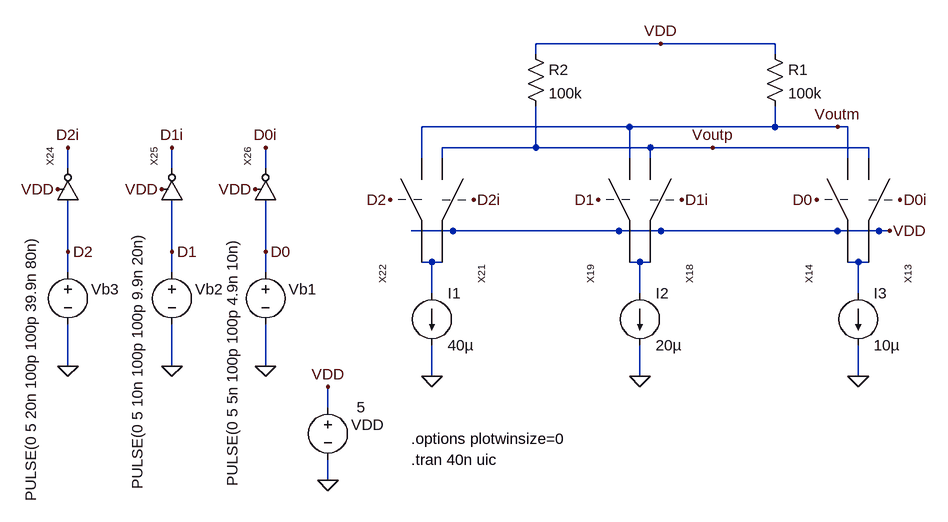
[diagram p0: schematic Fig29_10.asc]
Fig29_10.asc, the LTspice schematic file:
Version 4
SHEET 1 2492 2056
WIRE 1296 944 1104 944
WIRE 1472 944 1296 944
WIRE 1104 960 1104 944
WIRE 1472 960 1472 944
WIRE 1248 1072 928 1072
WIRE 1472 1072 1472 1040
WIRE 1472 1072 1248 1072
WIRE 1568 1072 1472 1072
WIRE 1584 1072 1568 1072
WIRE 1104 1104 1104 1040
WIRE 1104 1104 960 1104
WIRE 1280 1104 1104 1104
WIRE 1376 1104 1280 1104
WIRE 1616 1104 1376 1104
WIRE 928 1120 928 1072
WIRE 960 1120 960 1104
WIRE 1248 1120 1248 1072
WIRE 1280 1120 1280 1104
WIRE 1584 1120 1584 1072
WIRE 1616 1120 1616 1104
WIRE 384 1136 384 1104
WIRE 544 1136 544 1104
WIRE 688 1136 688 1104
WIRE 976 1232 912 1232
WIRE 1232 1232 976 1232
WIRE 1296 1232 1232 1232
WIRE 1568 1232 1296 1232
WIRE 1632 1232 1568 1232
WIRE 1648 1232 1632 1232
WIRE 384 1264 384 1184
WIRE 544 1264 544 1184
WIRE 688 1264 688 1184
WIRE 944 1280 928 1280
WIRE 960 1280 944 1280
WIRE 1264 1280 1248 1280
WIRE 1280 1280 1264 1280
WIRE 1600 1280 1584 1280
WIRE 1616 1280 1600 1280
WIRE 384 1296 384 1264
WIRE 544 1296 544 1264
WIRE 688 1296 688 1264
WIRE 944 1328 944 1280
WIRE 1264 1328 1264 1280
WIRE 1600 1328 1600 1280
WIRE 384 1440 384 1376
WIRE 544 1440 544 1376
WIRE 688 1440 688 1376
WIRE 944 1456 944 1408
WIRE 1264 1456 1264 1408
WIRE 1600 1456 1600 1408
WIRE 784 1504 784 1472
WIRE 784 1616 784 1584
FLAG 784 1616 0
FLAG 784 1472 VDD
FLAG 1536 1184 D0
FLAG 1664 1184 D0i
FLAG 1200 1184 D1
FLAG 1328 1184 D1i
FLAG 880 1184 D2
FLAG 1008 1184 D2i
FLAG 1648 1232 VDD
FLAG 688 1440 0
FLAG 544 1440 0
FLAG 384 1440 0
FLAG 688 1264 D0
FLAG 544 1264 D1
FLAG 384 1264 D2
FLAG 368 1168 VDD
FLAG 384 1104 D2i
FLAG 528 1168 VDD
FLAG 544 1104 D1i
FLAG 672 1168 VDD
FLAG 688 1104 D0i
FLAG 944 1456 0
FLAG 1264 1456 0
FLAG 1600 1456 0
FLAG 1296 944 VDD
FLAG 1568 1072 Voutm
FLAG 1376 1104 Voutp
SYMBOL voltage 784 1488 R0
WINDOW 0 36 42 Left 0
WINDOW 3 44 15 Left 0
WINDOW 123 0 0 Left 0
WINDOW 39 0 0 Left 0
SYMATTR InstName VDD
SYMATTR Value 5
SYMBOL switch_1 1600 1120 R90
SYMATTR InstName X13
SYMBOL switch_1 1600 1120 M90
SYMATTR InstName X14
SYMBOL switch_1 1264 1120 R90
SYMATTR InstName X18
SYMBOL switch_1 1264 1120 M90
SYMATTR InstName X19
SYMBOL switch_1 944 1120 R90
SYMATTR InstName X21
SYMBOL switch_1 944 1120 M90
SYMATTR InstName X22
SYMBOL voltage 688 1280 R0
WINDOW 0 36 42 Left 0
WINDOW 3 -51 345 VLeft 0
WINDOW 123 0 0 Left 0
WINDOW 39 0 0 Left 0
SYMATTR InstName Vb1
SYMATTR Value PULSE(0 5 5n 100p 100p 4.9n 10n)
SYMBOL voltage 544 1280 R0
WINDOW 0 36 42 Left 0
WINDOW 3 -53 350 VLeft 0
WINDOW 123 0 0 Left 0
WINDOW 39 0 0 Left 0
SYMATTR InstName Vb2
SYMATTR Value PULSE(0 5 10n 100p 100p 9.9n 20n)
SYMBOL voltage 384 1280 R0
WINDOW 0 36 42 Left 0
WINDOW 3 -57 368 VLeft 0
WINDOW 123 0 0 Left 0
WINDOW 39 0 0 Left 0
SYMATTR InstName Vb3
SYMATTR Value PULSE(0 5 20n 100p 100p 39.9n 80n)
SYMBOL inverter 384 1184 R270
SYMATTR InstName X24
SYMBOL inverter 544 1184 R270
SYMATTR InstName X25
SYMBOL inverter 688 1184 R270
SYMATTR InstName X26
SYMBOL current 944 1328 R0
SYMATTR InstName I1
SYMATTR Value 40µ
SYMBOL current 1264 1328 R0
SYMATTR InstName I2
SYMATTR Value 20µ
SYMBOL current 1600 1328 R0
SYMATTR InstName I3
SYMATTR Value 10µ
SYMBOL res 1456 944 R0
SYMATTR InstName R1
SYMATTR Value 100k
SYMBOL res 1088 944 R0
SYMATTR InstName R2
SYMATTR Value 100k
TEXT 912 1584 Left 0 !.tran 40n uic
TEXT 912 1552 Left 0 !.options plotwinsize=0

The netlist it stands for:
* Fig29_10.asc
VDD VDD 0 5
XX13 Voutp N003 D0i VDD switch_1  ; pins P1 P2 clk VDD
XX14 Voutm N003 D0 VDD switch_1  ; pins P1 P2 clk VDD
XX18 Voutp N002 D1i VDD switch_1  ; pins P1 P2 clk VDD
XX19 Voutm N002 D1 VDD switch_1  ; pins P1 P2 clk VDD
XX21 Voutp N001 D2i VDD switch_1  ; pins P1 P2 clk VDD
XX22 Voutm N001 D2 VDD switch_1  ; pins P1 P2 clk VDD
Vb1 D0 0 PULSE(0 5 5n 100p 100p 4.9n 10n)
Vb2 D1 0 PULSE(0 5 10n 100p 100p 9.9n 20n)
Vb3 D2 0 PULSE(0 5 20n 100p 100p 39.9n 80n)
XX24 D2 D2i VDD inverter  ; pins In Out VDD
XX25 D1 D1i VDD inverter  ; pins In Out VDD
XX26 D0 D0i VDD inverter  ; pins In Out VDD
I1 N001 0 40µ
I2 N002 0 20µ
I3 N003 0 10µ
R1 VDD Voutm 100k
R2 VDD Voutp 100k
.tran 40n uic
.options plotwinsize=0
.backanno
.end